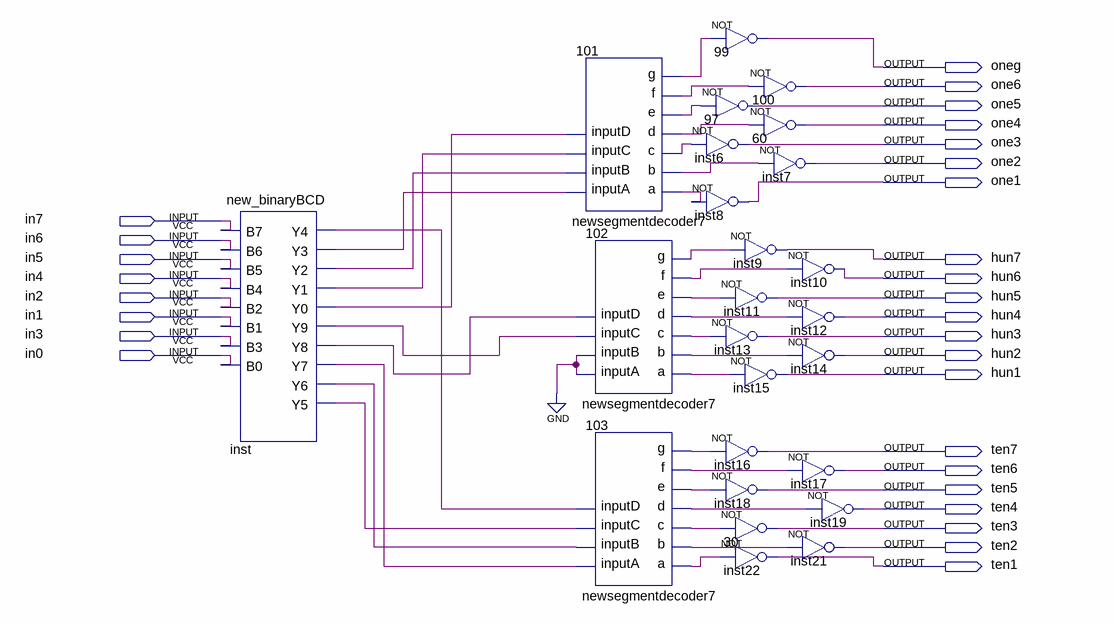
[diagram p0: schematic sheet]
// Quartus schematic Block1.bdf as structural Verilog: 25 symbols, 29 pins
module Block1 (
  input  in7,
  input  in6,
  input  in5,
  input  in4,
  input  in2,
  input  in1,
  input  in3,
  input  in0,
  output oneg,
  output one6,
  output one5,
  output one4,
  output one3,
  output one2,
  output one1,
  output hun7,
  output hun6,
  output hun5,
  output hun4,
  output hun3,
  output hun2,
  output hun1,
  output ten7,
  output ten6,
  output ten5,
  output ten4,
  output ten3,
  output ten2,
  output ten1
);

  wire inst_y0, inst_y1, inst_y2, inst_y3, inst_y4, inst_y5, inst_y6, inst_y7, inst_y8, inst_y9, n101_a,
       n101_b, n101_c, n101_d, n101_e, n101_f, n101_g, n102_a, n102_b, n102_c, n102_d, n102_e, n102_f,
       n102_g, n103_a, n103_b, n103_c, n103_d, n103_e, n103_f, n103_g;

  new_binaryBCD inst (
    .B7(in7), .B6(in6), .B5(in5), .B4(in4), .B2(in2), .B1(in1), .B3(in3), .B0(in0), .Y4(inst_y4),
    .Y3(inst_y3), .Y2(inst_y2), .Y1(inst_y1), .Y0(inst_y0), .Y9(inst_y9), .Y8(inst_y8), .Y7(inst_y7),
    .Y6(inst_y6), .Y5(inst_y5));
  newsegmentdecoder7 u_101 (
    .inputA(inst_y3), .inputB(inst_y2), .inputC(inst_y1), .inputD(inst_y0), .a(n101_a), .b(n101_b),
    .c(n101_c), .d(n101_d), .e(n101_e), .f(n101_f), .g(n101_g));
  newsegmentdecoder7 u_102 (
    .inputA(1'b0), .inputB(1'b0), .inputC(inst_y9), .inputD(inst_y8), .a(n102_a), .b(n102_b), .c(n102_c),
    .d(n102_d), .e(n102_e), .f(n102_f), .g(n102_g));
  newsegmentdecoder7 u_103 (
    .inputA(inst_y7), .inputB(inst_y6), .inputC(inst_y5), .inputD(inst_y4), .a(n103_a), .b(n103_b),
    .c(n103_c), .d(n103_d), .e(n103_e), .f(n103_f), .g(n103_g));
  not u_99 (oneg, n101_g);
  not u_100 (one6, n101_f);
  not u_97 (one5, n101_e);
  not u_60 (one4, n101_d);
  not inst6 (one3, n101_c);
  not inst8 (one1, n101_a);
  not inst9 (hun7, n102_g);
  not inst11 (hun5, n102_e);
  not inst13 (hun3, n102_c);
  not inst15 (hun1, n102_a);
  not inst16 (ten7, n103_g);
  not inst18 (ten5, n103_e);
  not u_30 (ten3, n103_c);
  not inst22 (ten1, n103_a);
  not inst7 (one2, n101_b);
  not inst10 (hun6, n102_f);
  not inst12 (hun4, n102_d);
  not inst14 (hun2, n102_b);
  not inst17 (ten6, n103_f);
  not inst19 (ten4, n103_d);
  not inst21 (ten2, n103_b);
endmodule
